# Altium schematic sheet Relay.SchDoc
size A3; CompanyName: Ok's Lab; Engineer: Oktay Topcu; SheetNumber: 7; SheetTotal: 7; UniqueID: 20200803; X2: A3; X3: 20200803; X4: r1.0; X6: 7; X7: 7; X8: Relay.SchDoc
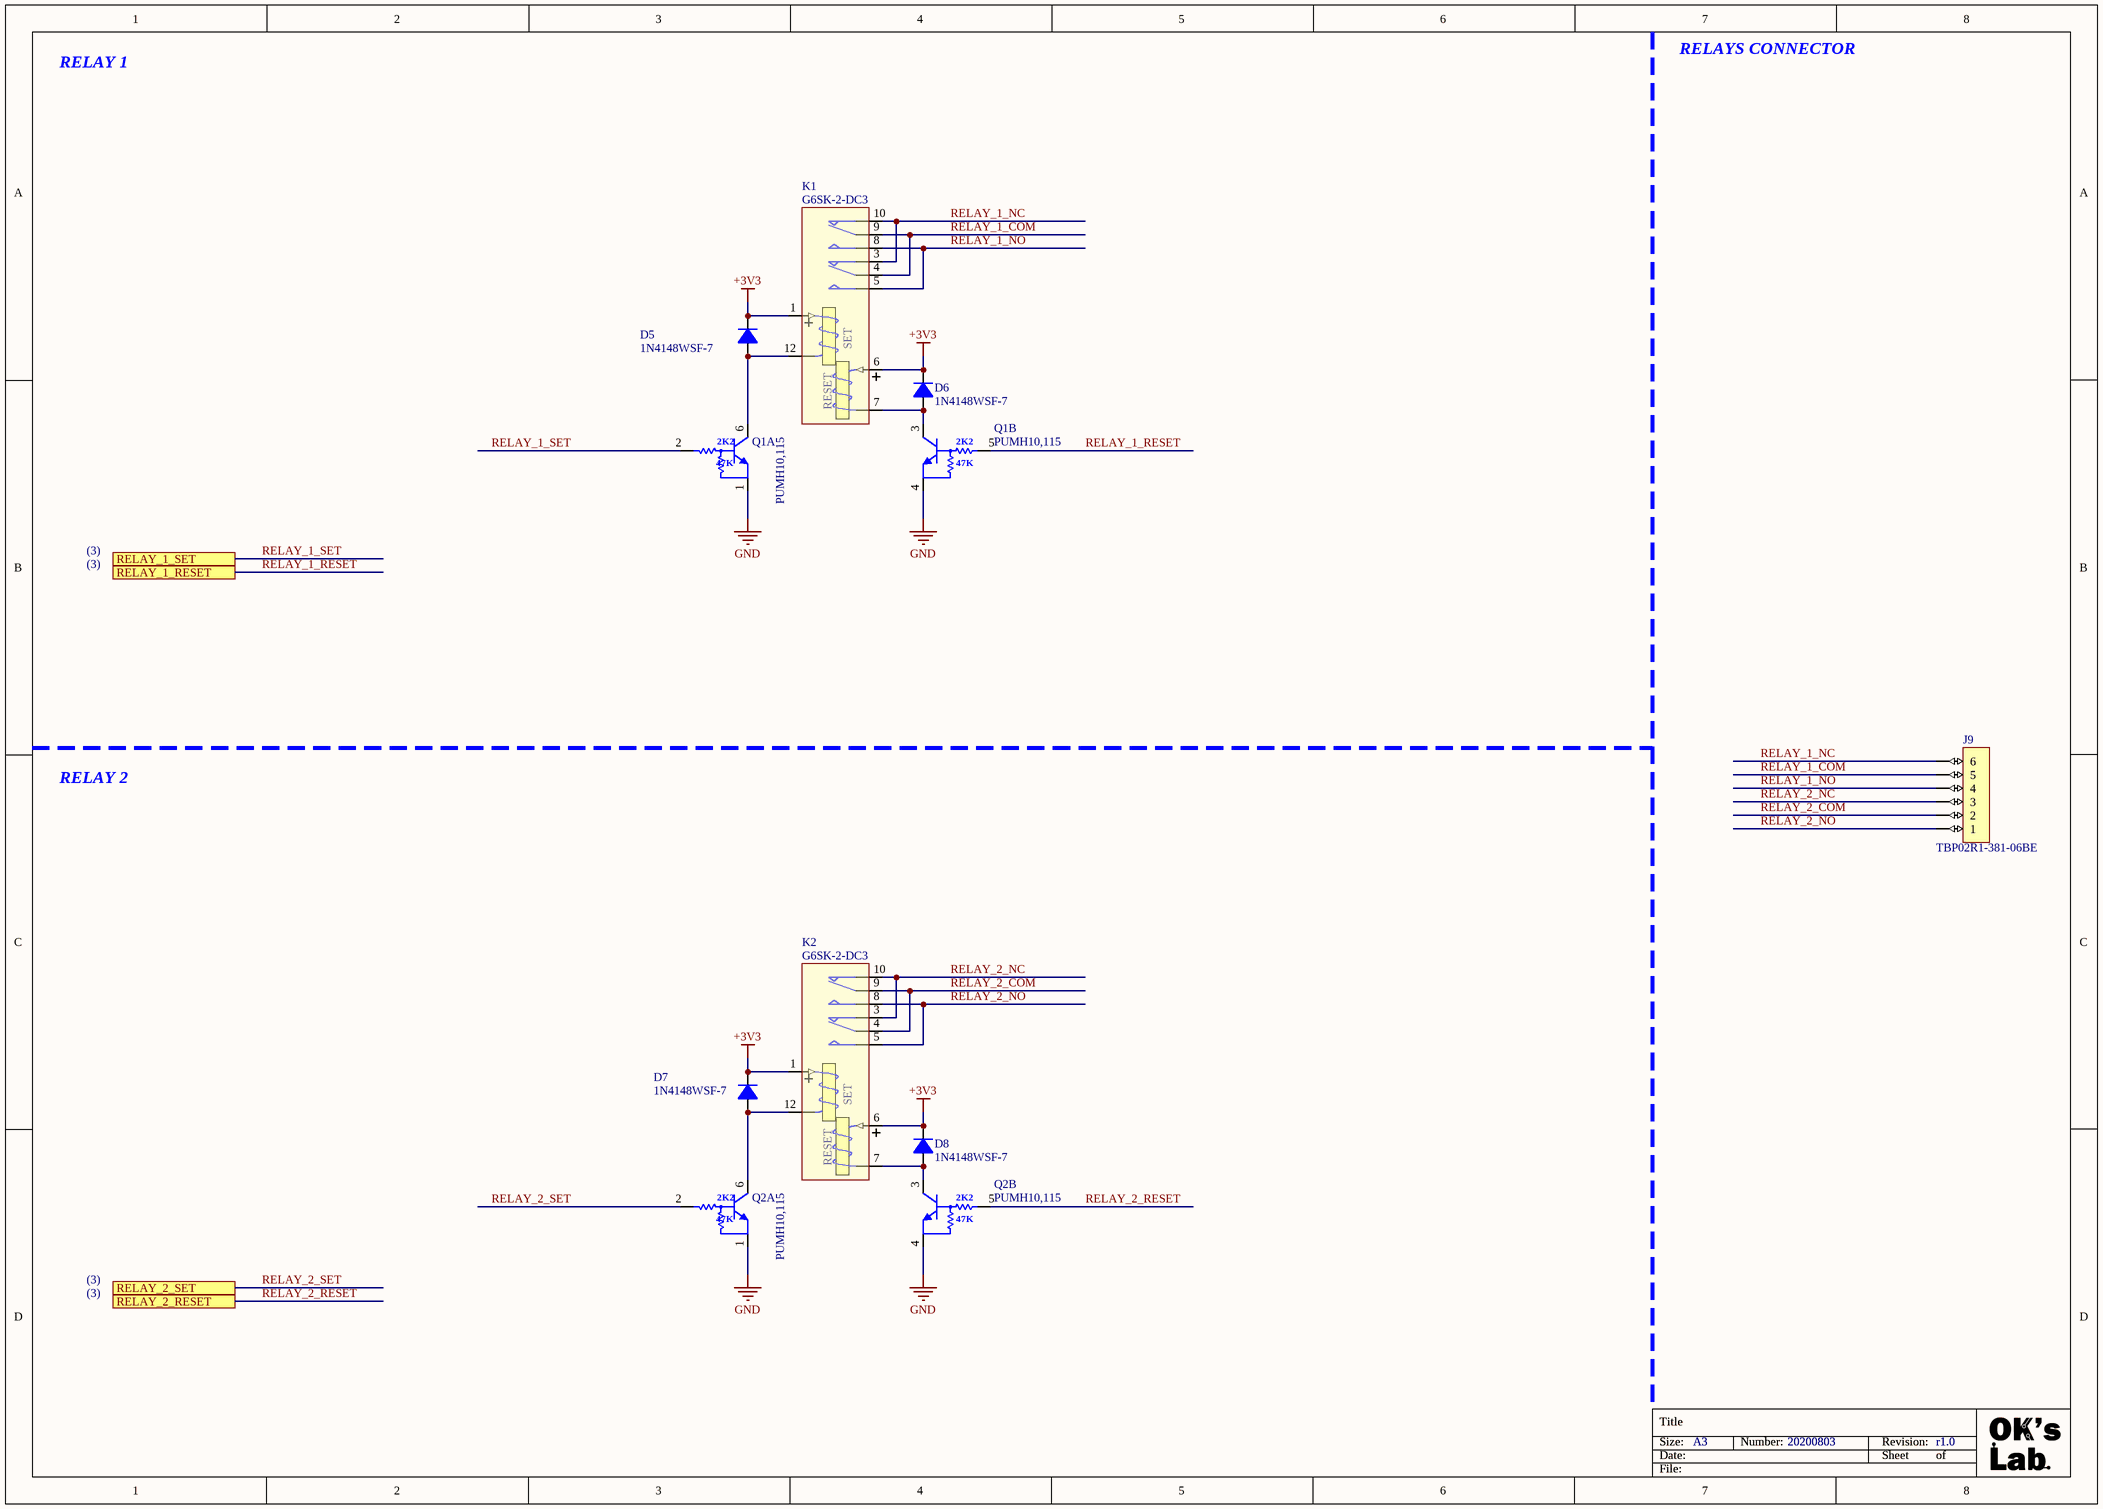
[diagram p0: Relay.SchDoc]

## Parts
D5  1N4148WSF-7  [SOD323F__SC90]
D6  1N4148WSF-7  [SOD323F__SC90]
D7  1N4148WSF-7  [SOD323F__SC90]
D8  1N4148WSF-7  [SOD323F__SC90]
J9  TBP02R1-381-06BE  [CONN_6_POS__TBP02R1-381-06BE]
K1  G6SK-2-DC3  [G6SK-2]
K2  G6SK-2-DC3  [G6SK-2]
Q1  PUMH10,115  [SOT-363]  (parts A,B of 2)
Q2  PUMH10,115  [SOT-363]  (parts A,B of 2)

## Ports
RELAY_1_RESET, RELAY_1_SET, RELAY_2_RESET, RELAY_2_SET

## Nets
+3V3: D5.2(K) D6.2(K) D7.2(K) D8.2(K) K1.1(T1) K1.6(T1) K2.1(T1) K2.6(T1)
GND: Q1.1(E1) Q1.4(E2) Q2.1(E1) Q2.4(E2)
RELAY_1_COM: J9.5 K1.4(COM_1) K1.9(COM_2)
RELAY_1_NC: J9.6 K1.3(NC_1) K1.10(NC_2)
RELAY_1_NO: J9.4 K1.5(NO_1) K1.8(NO_2)
RELAY_1_RESET: Q1.5(B2) ; port RELAY_1_RESET
RELAY_1_SET: Q1.2(B1) ; port RELAY_1_SET
RELAY_2_COM: J9.2 K2.4(COM_1) K2.9(COM_2)
RELAY_2_NC: J9.3 K2.3(NC_1) K2.10(NC_2)
RELAY_2_NO: J9.1 K2.5(NO_1) K2.8(NO_2)
RELAY_2_RESET: Q2.5(B2) ; port RELAY_2_RESET
RELAY_2_SET: Q2.2(B1) ; port RELAY_2_SET
NetD5_1: D5.1(A) K1.12(T2) Q1.6(C1)
NetD6_1: D6.1(A) K1.7(T2) Q1.3(C2)
NetD7_1: D7.1(A) K2.12(T2) Q2.6(C1)
NetD8_1: D8.1(A) K2.7(T2) Q2.3(C2)

## Notes on the sheet
- RELAY 1
- RELAYS CONNECTOR
- (3)
- RELAY 2
- Title
- Size:
- Date:
- Number:
- Revision:
- Sheet
- of
- File:
- (in symbol PUMH10,115, part A) 2K2; 47K
- (in symbol PUMH10,115, part B) 2K2; 47K
- (in symbol RELAY__G6SK-2 DC3) SET; RESET

## Library data of the parts
D5-D8 = DIODE_1N4148WSF-7: DIODE GEN PURP 100V 250MA SOD323; Manufacturer: Diodes; Reverse Recovery Time: 4ns; Peak Non-Repetitive Surge Current: 4A; Element Configuration: Single; Supplier 1: Avnet; Manufacturer Part Number: 1N4148WSF-7; Stock 1: 0; Pricing 1: 3000=0.0321, 6000=0.0289, 12000=0.0289, 18000=0.0251, 24000=0.0251, 30000=0.0225, 300000=0.02 (USD); Mount: Surface Mount; Case/Package: SOD; Number of Pins: 2; Contact Plating: Tin,Matte; Min Operating Temperature: -55°C; Max Operating Temperature: 150°C; Package Quantity: 3000; Packaging: Tape and Reel; Forward Current: 250mA; Average Rectified Current: 250mA; Max Repetitive Reverse Voltage (Vrrm): 100V; Max Reverse Voltage (DC): 100V; Lead Free: Lead Free; RoHS Compliant: Yes; Supplier Part Number 1: 1N4148WSF-7
J9 = CONN_6_POS__TBP02R1-381-06BE: TERMINAL BLOCK, PLUGGABLE, 3.81,; Manufacturer: CUI Devices; Product Status: New Product; Supplier 1: Mouser; Manufacturer Part Number: TBP02R1-381-06BE; RoHS: RoHS Compliant; Category: Pluggable Terminal Blocks; Stock 1: 0; Pricing 1: 1=0.00 (AUD); Minimum Order Quantity: 1; Reeling: False
K1 K2 = RELAY__G6SK-2 DC3: Telecom Relay DPDT (2 Form C) Through Hole; Manufacturer: Omron; Contact Current Rating: 2A; Coil Current: 66.7mA; Operate Time: 4ms; Coil Power: 200mW; Coil Resistance: 45R; Coil Type: Latching, Dual Coil; Coil Voltage (DC): 3V; Max Voltage Rating (AC): 250V; Max Voltage Rating (DC): 220V; Supplier 1: Avnet; Manufacturer Part Number: G6SK-2-DC3; Stock 1: 0; Pricing 1: 1000=2.6926, 2000=2.6078, 4000=2.4853, 6000=2.4153, 8000=2.3278, 10000=2.2578, 100000=2.1878 (USD); Mount: Through Hole; Case/Package: DIP; Number of Pins: 8; Contact Material: Gold,Silver; Weight: 2g; Min Operating Temperature: -40°C; Max Operating Temperature: 70°C; Package Quantity: 50; Packaging: Rail/Tube; Termination: PC Pin; Throw Configuration: DPDT; Release Time: 4ms; Relay Type: Telecom; Max Current Rating: 2A; Power Consumption: 200mW; Series: G6S; Radiation Hardening: No; ComponentLink1URL: http://www.components.omron.com/components/web/PDFLIB.nsf/0/3AB780E03885359085257201007DD68A/$file/G6S_1012.pdf?src-supplier=Mouser; ComponentLink1Description: http://www.components.omron.com/components/web/PDFLIB.nsf/0/3AB780E03885359085257201007DD68A/$file/G6S_1012.pdf?src-supplier=Mouser; ComponentLink2URL: http://www.components.omron.com/components/web/PDFLIB.nsf/0/3AB780E03885359085257201007DD68A/$file/G6S_0514.pdf?src-supplier=Digi-Key; ComponentLink2Description: http://www.components.omron.com/components/web/PDFLIB.nsf/0/3AB780E03885359085257201007DD68A/$file/G6S_0514.pdf?src-supplier=Digi-Key; Supplier Part Number 1: G6SK2DC3BYOMZ
Q1 Q2 = PUMH10,115: TRANS 2NPN PREBIAS 0.3W 6TSSOP; Manufacturer: Nexperia USA Inc.; Transistor Type: 2 NPN - Pre-Biased (Dual); Resistor - Emitter Base (R2) (Ohms): 47k; Vce Saturation (Max) @ Ib, Ic: 100mV @ 250µA, 5mA; DC Current Gain (hFE) (Min) @ Ic, Vce: 100 @ 10mA, 5V; Voltage - Collector Emitter Breakdown (Max): 50V; Current - Collector (Ic) (Max): 100mA; Resistor - Base (R1) (Ohms): 2.2k; Power - Max: 300mW; Current - Collector Cutoff (Max): 1µA; Package / Case: 6-TSSOP, SC-88, SOT-363; Supplier Device Package: 6-TSSOP; Manufacturer Part Number: PUMH10,115; Category: Discrete Semiconductor Products; Mounting Type: Surface Mount; Part Status: Active; RoHS: RoHS Compliant; Supplier: Digi-Key; Packaging: Cut Tape (CT); Frequency - Transition: -; ComponentLink1URL: http://assets.nexperia.com/documents/data-sheet/PEMH10_PUMH10.pdf; ComponentLink1Description: http://assets.nexperia.com/documents/data-sheet/PEMH10_PUMH10.pdf; Supplier Part Number: 1727-5235-1-ND